# Altium schematic sheet SAM_E54_Xplained_Pro_current_measurement_frontend.SchDoc: Current measurement frontend
size A3; Organization: ATMEL Norway; Address1: Vestre Rosten 79; Address2: N-7075 TILLER; Address3: NORWAY; DocumentNumber: A09-2748; Revision: 4; SheetNumber: 13; SheetTotal: 13; PageSetup: Record=PageOptions|CenterHorizontal=True|CenterVertical=True|PrintScale=1.01|XCorrection=1.00|YCorrection=1.00|PrintKind=1|BorderSize=5000000|LeftOffset=0|BottomOffset=0|Orientation=2|PaperLength=1000|PaperWidth=1000|Scale=100|PaperSource=7|PrintQuality=-4|MediaType=1|DitherType=10|PaperKind=A3 (297 x 420 mm)|PrintScaleMode=1
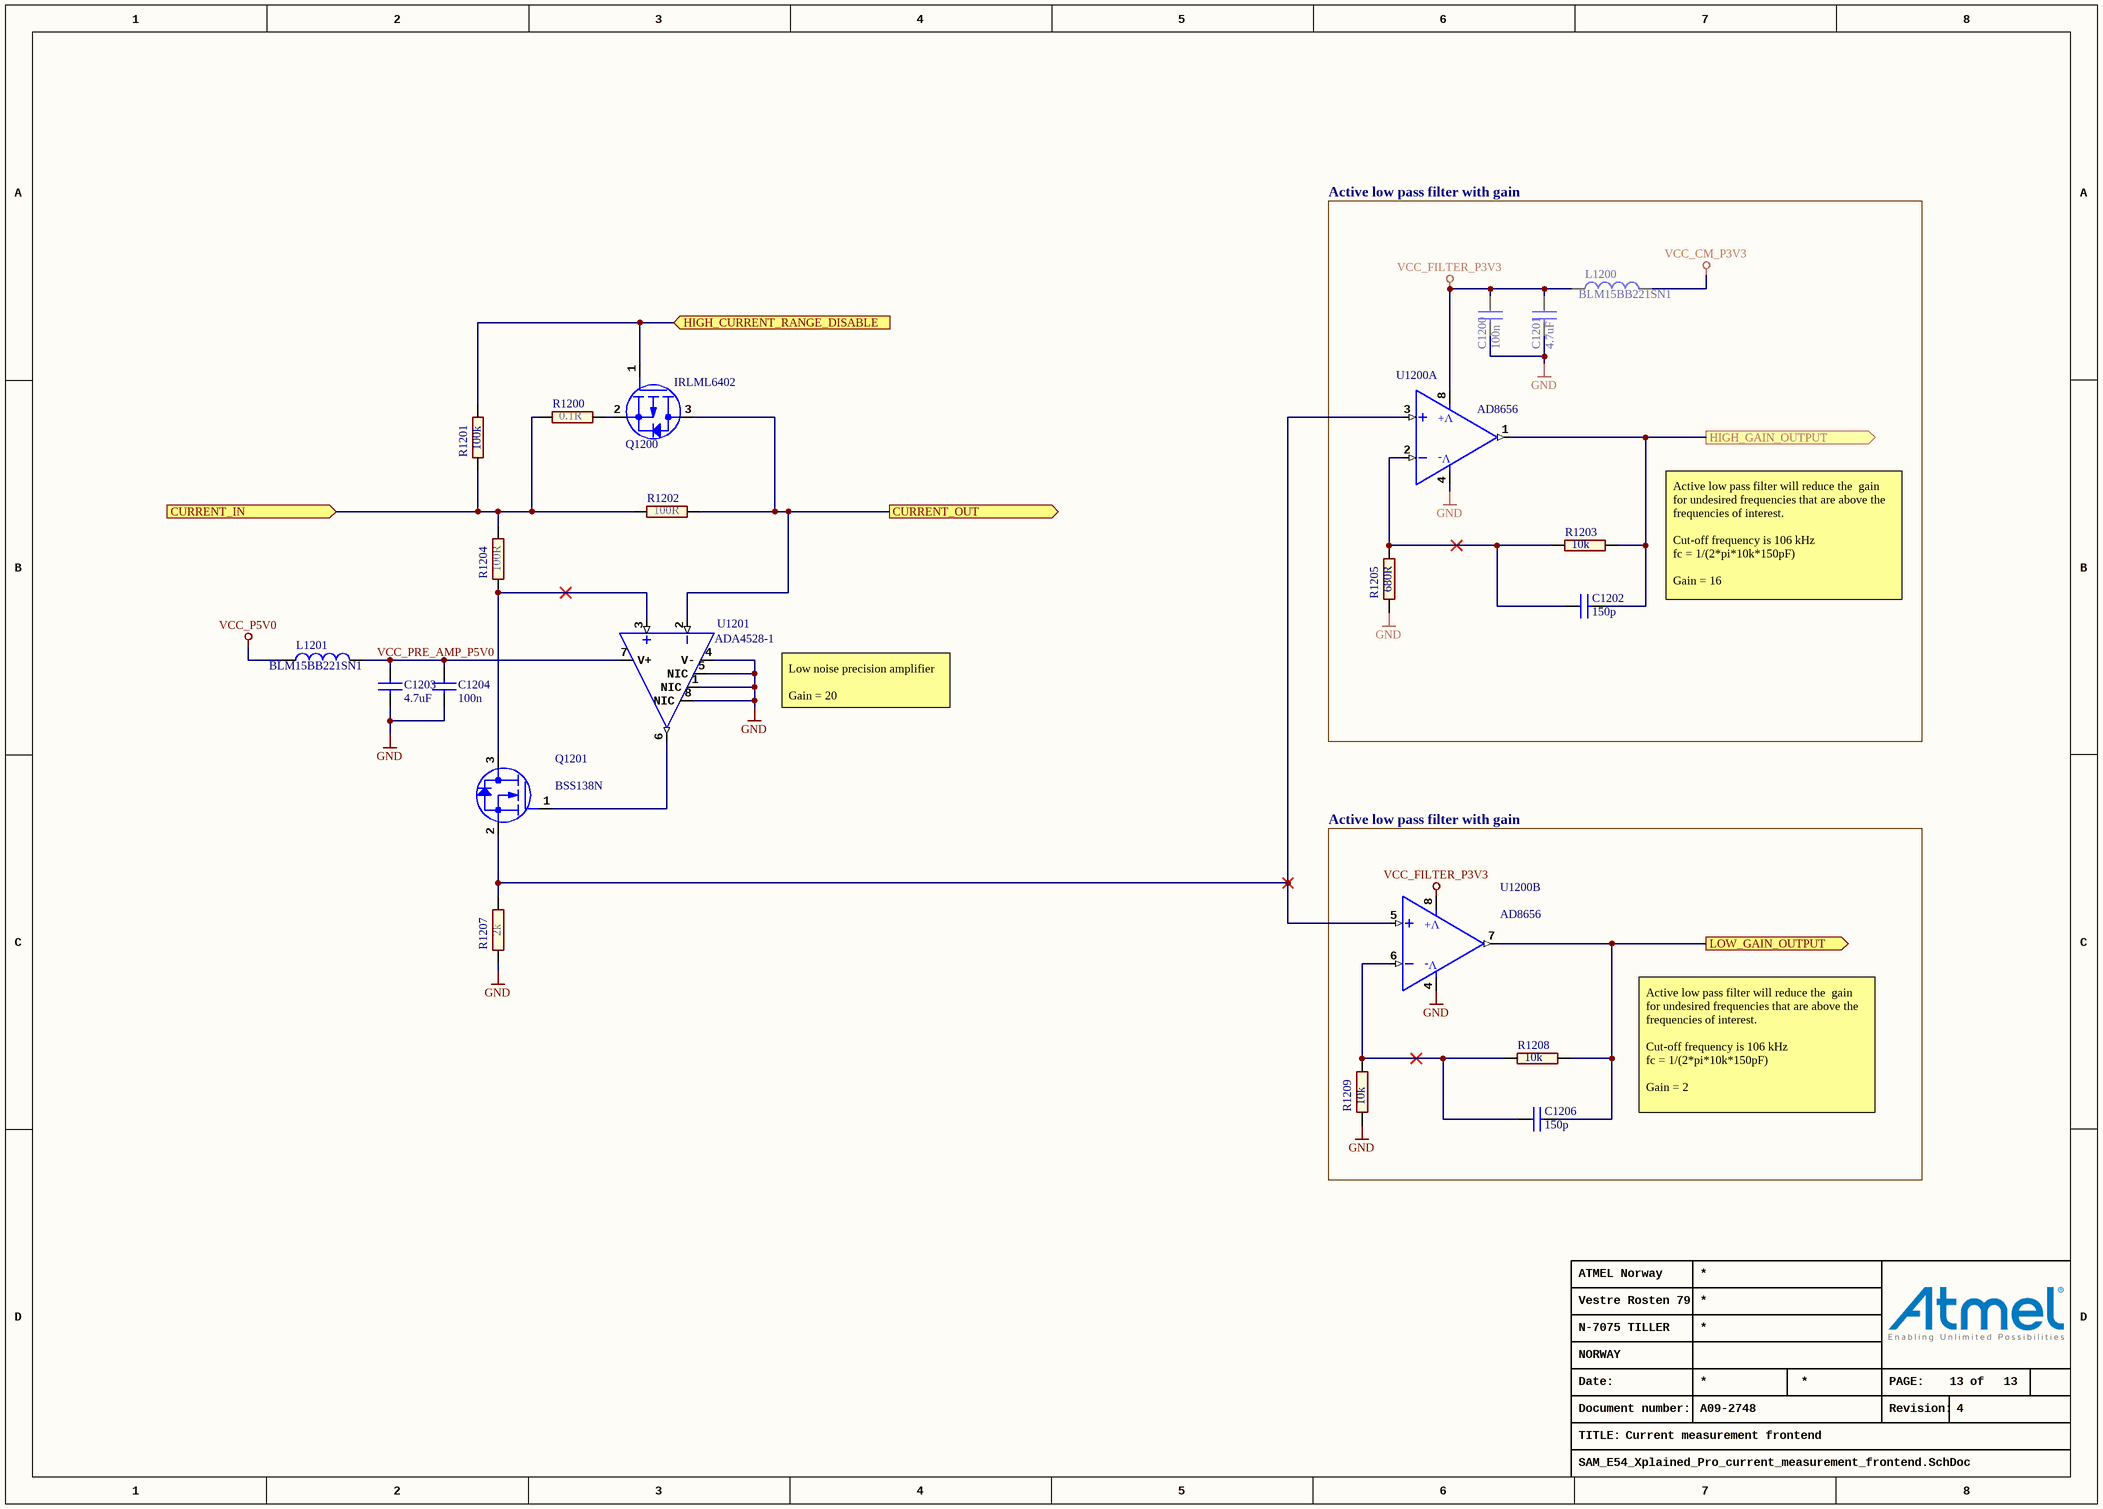
[diagram p0: SAM_E54_Xplained_Pro_current_measurement_frontend.SchDoc]

## Parts
C1200  value 100n  [AP1-00053]
C1201  value 4.7uF  [AP1-00117]
C1202  value 150p  [AP1-00053]
C1203  value 4.7uF  [AP1-00117]
C1204  value 100n  [AP1-00053]
C1206  value 150p  [AP1-00053]
L1200  value BLM15BB221SN1  [AP3-00028]
L1201  value BLM15BB221SN1  [AP3-00028]
Q1200  value IRLML6402  [AP5-00002]
Q1201  value BSS138N  [AP5-00002]
R1200  value 0.1R  [AP2-00076]
R1201  value 100k  [AP2-00011]
R1202  value 100R  [AP2-00076]
R1203  value 10k  [AP2-00011]
R1204  value 100R  [AP2-00076]
R1205  value 680R  [AP2-00011]
R1207  value 2k  [AP2-00011]
R1208  value 10k  [AP2-00011]
R1209  value 10k  [AP2-00011]
U1200  value AD8656  [AP6-00100]  (parts A,B of 2)
U1201  value ADA4528-1  [AP6-00100]

## Blocks framed on the sheet
Active low pass filter with gain: C1200-C1202 L1200 R1203 R1205 U1200
Active low pass filter with gain: C1206 R1208 R1209 U1200

## Ports
CURRENT_IN (in), CURRENT_OUT (out), HIGH_CURRENT_RANGE_DISABLE (in), HIGH_GAIN_OUTPUT (out), LOW_GAIN_OUTPUT (out)

## Nets
GND: C1200.2 C1201.2 C1203.2 C1204.2 R1205.1 R1207.1 R1209.1 U1200.4(V-) U1201.1(NIC) U1201.4(V-) U1201.5(NIC) U1201.8(NIC)
VCC_CM_P3V3: L1200.1
VCC_FILTER_P3V3: C1200.1 C1201.1 L1200.2 U1200.8(V+)
VCC_P5V0: L1201.1
CURRENT_IN: R1200.1 R1201.1 R1202.1 R1204.2 ; port CURRENT_IN
CURRENT_OUT: Q1200.3(D) R1202.2 U1201.2(IN-) ; port CURRENT_OUT
HIGH_CURRENT_RANGE_DISABLE: Q1200.1(G) R1201.2 ; port HIGH_CURRENT_RANGE_DISABLE
HIGH_GAIN_OUTPUT: C1202.2 R1203.2 U1200.1(OUTA) ; port HIGH_GAIN_OUTPUT
LOW_GAIN_OUTPUT: C1206.2 R1208.2 U1200.7(OUTB) ; port LOW_GAIN_OUTPUT
VCC_PRE_AMP_P5V0: C1203.1 C1204.1 L1201.2 U1201.7(V+)
NetC1202_1: C1202.1 R1203.1 R1205.2 U1200.2(INA_-)
NetC1206_1: C1206.1 R1208.1 R1209.2 U1200.6(INB_-)
NetQ1200_2: Q1200.2(S) R1200.2
NetQ1201_1: Q1201.1(G) U1201.6(OUT)
NetQ1201_2: Q1201.2(S) R1207.2 U1200.3(INA_+) U1200.5(INB_+)
NetQ1201_3: Q1201.3(D) R1204.1 U1201.3(IN+)

## Notes on the sheet
- Active low pass filter will reduce the  gain for undesired frequencies that are above the frequencies of interest.
  Cut-off frequency is 106 kHz
  fc = 1/(2*pi*10k*150pF)
  Gain = 16
- Low noise precision amplifier
  Gain = 20
- Active low pass filter will reduce the  gain for undesired frequencies that are above the frequencies of interest.
  Cut-off frequency is 106 kHz
  fc = 1/(2*pi*10k*150pF)
  Gain = 2
- Date:
- PAGE:
- of
- TITLE:
- Document number:
- Revision:

## Library data of the parts
C1200 C1204 = A01-0246: Ceramic capacitor, SMD 0402, X7R, 16V, +/-10%; PartGroup: Capacitors,Ceramic,SMD 0402; Manufacturer: Kemet; MPN: C0402C104K4RACTU; TemperatureRange: -55 - +125 deg C; AN: A01-0246; Tolerance: 16V, +/-10%; Height: 0,5
C1201 C1203 = A01-0377: Ceramic capacitor, SMD 0603, X5R, 10V, 10% (de31036); PartGroup: Capacitors,Ceramic,SMD 0603; Manufacturer: WALSIN Technology Corporation; MPN: 0603X475K100CT; TemperatureRange: -55 - +85 deg C; AN: A01-0377; Tolerance: 10%; Height: 0,800000011920929
C1202 C1206 = A01-0028: Ceramic capacitor, SMD 0402, X7R, 50V, +/-10%; PartGroup: Capacitors,Ceramic,SMD 0402; Manufacturer: YAGEO CORP; MPN: CC0402KRX7R9BB151; TemperatureRange: -55 - +125 deg C; AN: A01-0028; Tolerance: 50V, +/-10%; Height: 0,550000011920929
L1200 L1201 = A03-0037: SMD RF inductor 0402. Z=220Ohm (@100MHz), Max R(dc)=0.80Ohm, Max current=200mA; PartGroup: Inductors,EMI; Manufacturer: Murata; Tolerance: ±25%; TemperatureRange: -55°C to +125°C; AN: A03-0037; Height: 0,5; MPN: BLM15BB221SN1
Q1200 = A05-0087: P-ch. MOSFET. -30V, -3.7A continuous,RDS(ON)=0.05Ohm@VGS=-4,5V, RDS(ON)=0.08Ohm@VGS=-2.5V; PartGroup: Transistors,Power FET,SMD; Manufacturer: International Rectifier; MPN: IRLML6402PBF; TemperatureRange: -55 - +150 deg C; AN: A05-0087; Height: 1,14999997615814
Q1201 = A05-0140: Low leakage N-Channel MOSFET. 60V, 0.23A continuous, 0.92A Peak. RDS(ON) = 3.5Ohm@VGS=4.5V, VGS(th)<1.4V; PartGroup: Transistors,Small signal FET,SMD; Manufacturer: Infineon; TemperatureRange: -55  to +150 deg celcius; AN: A05-0140; Height: 1,10000002384186; MPN: BSS138N
R1200 = A02-0896: WSL0603R1000FEA, metal strip resistor, 0.1 Ohm, +-1%, 0603 SMD, 1/10 W, TEMPCO +-75 ppm/Â°C; PartGroup: Resistors,Sense resistors,SMD Current Sense; Manufacturer: vishay; AN: A02-0896; Height: 0,330000013113022; MPN: WSL0603R1000FEA
R1201 = A02-0260: Thick film resistor, SMD 0402, 1/16W, 1%; PartGroup: Resistors,SMD,0402 1%; Manufacturer: ASJ; MPN: CR10-1003-FK; TemperatureRange: -55ï¿½ to +125ï¿½C; AN: A02-0260; Tolerance: 1 %; Height: 0,349999994039536
R1202 R1204 = A02-0895: ERA-3YEB101V, metal film, 100R Â±0.1%, resistor in 0603 at 100mW, TEMPCO Â±25ppm/Â°C, Max V=75V; PartGroup: Resistors,Metal film,SMD Precision resistors; Manufacturer: Panasonic; MPN: ERA3YEB101V; AN: A02-0895; Height: 0,550000011920929
R1203 R1208 R1209 = A02-0236: Thick film resistor, SMD 0402, 1/16W, 1%; PartGroup: Resistors,SMD,0402 1%; Manufacturer: vishay; MPN: CRCW040210K0FKED; TemperatureRange: -55 - +125 deg C; AN: A02-0236; Tolerance: 1 %; Height: 0,349999994039536
R1205 = A02-0208: Thick film resistor, SMD 0402, 1/16W, 1%; PartGroup: Resistors,SMD,0402 1%; Manufacturer: ASJ; MPN: CR10-6800-FK; TemperatureRange: -55 - +125 deg C; AN: A02-0208; Tolerance: 1 %; Height: 0,349999994039536
R1207 = A02-0219: Thick film resistor, SMD 0402, 1/16W, 1%; PartGroup: Resistors,SMD,0402 1%; TemperatureRange: -55 - +125 deg C; AN: A02-0219; Tolerance: 1 %; Height: 0,349999994039536
U1200 = A06-1125: AD8656, dual low noise precision OpAmp, rail-to-rail, low offset 250uV, GBP 28 MHz, 8MSOP; PartGroup: Integrated Circuits,General linear,OP-AMP; Manufacturer: Analog Devices; MPN: AD8656ARMZ; TemperatureRange: -40 to +125 deg celcius; AN: A06-1125; Height: 1,10000002384186
U1201 = A06-1134: Precision OpAmp, Zero-Drift 0.015uV/K, ultra low noise 5.6nV/sqrt(Hz), Vo=2uV, GBW=4MHz, single supply 2.2V to 5.5V or dual supply +-1V to +-2.75V, rail to rail, unity gain stable; PartGroup: Integrated Circuits,General linear,OP-AMP; Manufacturer: Analog Devices; MPN: ADA4528-1ARMZ; AN: A06-1134; Height: 1,10000002384186